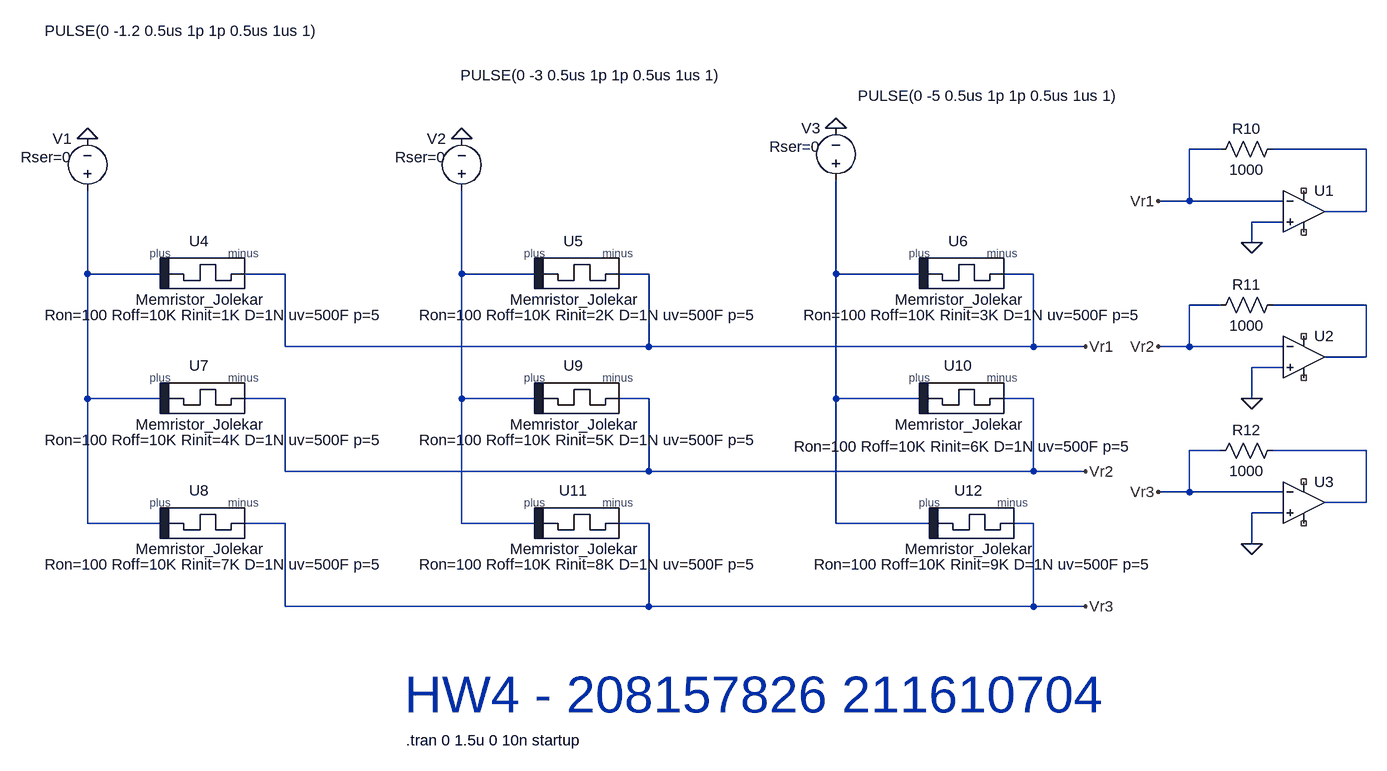
[diagram p0: schematic Q1_part_d.asc]
Q1_part_d.asc, the LTspice schematic file:
Version 4
SHEET 1 1608 768
WIRE 1008 -160 960 -160
WIRE 1232 -160 1088 -160
WIRE 960 -80 960 -160
WIRE 960 -80 912 -80
WIRE 1104 -80 960 -80
WIRE 1232 -64 1232 -160
WIRE 1232 -64 1168 -64
WIRE 1104 -48 1056 -48
WIRE 1056 -16 1056 -48
WIRE -736 32 -736 -96
WIRE -624 32 -736 32
WIRE -432 32 -496 32
WIRE -160 32 -160 -96
WIRE -48 32 -160 32
WIRE 128 32 80 32
WIRE 416 32 416 -112
WIRE 544 32 416 32
WIRE 720 32 672 32
WIRE 1008 80 960 80
WIRE 1232 80 1088 80
WIRE -432 144 -432 32
WIRE 128 144 128 32
WIRE 128 144 -432 144
WIRE 720 144 720 32
WIRE 720 144 128 144
WIRE 800 144 720 144
WIRE 960 144 960 80
WIRE 960 144 912 144
WIRE 1104 144 960 144
WIRE 1232 160 1232 80
WIRE 1232 160 1168 160
WIRE 1104 176 1056 176
WIRE -736 224 -736 32
WIRE -624 224 -736 224
WIRE -432 224 -496 224
WIRE -160 224 -160 32
WIRE -48 224 -160 224
WIRE 128 224 80 224
WIRE 416 224 416 32
WIRE 544 224 416 224
WIRE 720 224 672 224
WIRE 1056 224 1056 176
WIRE 1008 304 960 304
WIRE 1232 304 1088 304
WIRE -432 336 -432 224
WIRE 128 336 128 224
WIRE 128 336 -432 336
WIRE 720 336 720 224
WIRE 720 336 128 336
WIRE 800 336 720 336
WIRE 960 368 960 304
WIRE 960 368 912 368
WIRE 1104 368 960 368
WIRE 1232 384 1232 304
WIRE 1232 384 1168 384
WIRE 1104 400 1056 400
WIRE -736 416 -736 224
WIRE -624 416 -736 416
WIRE -432 416 -496 416
WIRE -160 416 -160 224
WIRE -48 416 -160 416
WIRE 128 416 80 416
WIRE 416 416 416 224
WIRE 560 416 416 416
WIRE 720 416 688 416
WIRE 1056 448 1056 400
WIRE -432 544 -432 416
WIRE 128 544 128 416
WIRE 128 544 -432 544
WIRE 720 544 720 416
WIRE 720 544 128 544
WIRE 800 544 720 544
FLAG -736 -176 0
FLAG -160 -176 0
FLAG 416 -192 0
FLAG 800 144 Vr1
FLAG 800 336 Vr2
FLAG 800 544 Vr3
FLAG 1056 -16 0
FLAG 1056 224 0
FLAG 1056 448 0
FLAG 912 -80 Vr1
FLAG 912 144 Vr2
FLAG 912 368 Vr3
SYMBOL voltage -736 -80 R180
WINDOW 0 24 96 Left 2
WINDOW 3 -356 262 Left 2
WINDOW 123 0 0 Left 0
WINDOW 39 24 68 Left 2
SYMATTR InstName V1
SYMATTR Value PULSE(0 -1.2 0.5us 1p 1p 0.5us 1us 1)
SYMATTR SpiceLine Rser=0
SYMBOL voltage -160 -80 R180
WINDOW 0 24 96 Left 2
WINDOW 3 -400 194 Left 2
WINDOW 123 0 0 Left 0
WINDOW 39 24 68 Left 2
SYMATTR InstName V2
SYMATTR Value PULSE(0 -3 0.5us 1p 1p 0.5us 1us 1)
SYMATTR SpiceLine Rser=0
SYMBOL voltage 416 -96 R180
WINDOW 0 24 96 Left 2
WINDOW 3 -436 146 Left 2
WINDOW 123 0 0 Left 0
WINDOW 39 24 68 Left 2
SYMATTR InstName V3
SYMATTR Value PULSE(0 -5 0.5us 1p 1p 0.5us 1us 1)
SYMATTR SpiceLine Rser=0
SYMBOL OpAmps\\UniversalOpAmp 1136 -64 R0
SYMATTR InstName U1
SYMATTR Value2 Avol=10Meg GBW=1000Meg Vos=0
SYMBOL OpAmps\\UniversalOpAmp 1136 160 R0
SYMATTR InstName U2
SYMATTR Value2 Avol=10Meg GBW=1000Meg Vos=0
SYMBOL OpAmps\\UniversalOpAmp 1136 384 R0
SYMATTR InstName U3
SYMATTR Value2 Avol=10Meg GBW=1000Meg Vos=0
SYMBOL res 1104 -176 R90
WINDOW 0 0 56 VBottom 2
WINDOW 3 32 56 VTop 2
SYMATTR InstName R10
SYMATTR Value 1000
SYMBOL res 1104 64 R90
WINDOW 0 0 56 VBottom 2
WINDOW 3 32 56 VTop 2
SYMATTR InstName R11
SYMATTR Value 1000
SYMBOL res 1104 288 R90
WINDOW 0 0 56 VBottom 2
WINDOW 3 32 56 VTop 2
SYMATTR InstName R12
SYMATTR Value 1000
SYMBOL Jolekar -560 32 R0
SYMATTR InstName U4
SYMATTR SpiceLine Ron=100 Roff=10K Rinit=1K D=1N uv=500F p=5
SYMBOL Jolekar 16 32 R0
SYMATTR InstName U5
SYMATTR SpiceLine Ron=100 Roff=10K Rinit=2K D=1N uv=500F p=5
SYMBOL Jolekar 608 32 R0
SYMATTR InstName U6
SYMATTR SpiceLine Ron=100 Roff=10K Rinit=3K D=1N uv=500F p=5
SYMBOL Jolekar -560 224 R0
SYMATTR InstName U7
SYMATTR SpiceLine Ron=100 Roff=10K Rinit=4K D=1N uv=500F p=5
SYMBOL Jolekar -560 416 R0
SYMATTR InstName U8
SYMATTR SpiceLine Ron=100 Roff=10K Rinit=7K D=1N uv=500F p=5
SYMBOL Jolekar 16 224 R0
SYMATTR InstName U9
SYMATTR SpiceLine Ron=100 Roff=10K Rinit=5K D=1N uv=500F p=5
SYMBOL Jolekar 608 224 R0
WINDOW 39 5 58 Top 2
SYMATTR InstName U10
SYMATTR SpiceLine Ron=100 Roff=10K Rinit=6K D=1N uv=500F p=5
SYMBOL Jolekar 16 416 R0
SYMATTR InstName U11
SYMATTR SpiceLine Ron=100 Roff=10K Rinit=8K D=1N uv=500F p=5
SYMBOL Jolekar 624 416 R0
SYMATTR InstName U12
SYMATTR SpiceLine Ron=100 Roff=10K Rinit=9K D=1N uv=500F p=5
TEXT -246 750 Left 2 !.tran 0 1.5u 0 10n startup
TEXT -248 680 Left 6 ;HW4 - 208157826 211610704

The netlist it stands for:
* Q1_part_d.asc
V1 N002 0 PULSE(0 -1.2 0.5us 1p 1p 0.5us 1us 1) Rser=0
V2 N003 0 PULSE(0 -3 0.5us 1p 1p 0.5us 1us 1) Rser=0
V3 N004 0 PULSE(0 -5 0.5us 1p 1p 0.5us 1us 1) Rser=0
XU1 0 Vr1 NC_01 NC_02 N001 level1 Avol=10Meg GBW=1000Meg Vos=0 En=0 Enk=0 In=0 Ink=0 Rin=500Meg  ; pins In+ In- V+ V- OUT
XU2 0 Vr2 NC_03 NC_04 N005 level1 Avol=10Meg GBW=1000Meg Vos=0 En=0 Enk=0 In=0 Ink=0 Rin=500Meg  ; pins In+ In- V+ V- OUT
XU3 0 Vr3 NC_05 NC_06 N006 level1 Avol=10Meg GBW=1000Meg Vos=0 En=0 Enk=0 In=0 Ink=0 Rin=500Meg  ; pins In+ In- V+ V- OUT
R10 N001 Vr1 1000
R11 N005 Vr2 1000
R12 N006 Vr3 1000
XU4 N002 Vr1 Memristor_Jolekar Ron=100 Roff=10K Rinit=1K D=1N uv=500F p=5  ; pins plus minus
XU5 N003 Vr1 Memristor_Jolekar Ron=100 Roff=10K Rinit=2K D=1N uv=500F p=5  ; pins plus minus
XU6 N004 Vr1 Memristor_Jolekar Ron=100 Roff=10K Rinit=3K D=1N uv=500F p=5  ; pins plus minus
XU7 N002 Vr2 Memristor_Jolekar Ron=100 Roff=10K Rinit=4K D=1N uv=500F p=5  ; pins plus minus
XU8 N002 Vr3 Memristor_Jolekar Ron=100 Roff=10K Rinit=7K D=1N uv=500F p=5  ; pins plus minus
XU9 N003 Vr2 Memristor_Jolekar Ron=100 Roff=10K Rinit=5K D=1N uv=500F p=5  ; pins plus minus
XU10 N004 Vr2 Memristor_Jolekar Ron=100 Roff=10K Rinit=6K D=1N uv=500F p=5  ; pins plus minus
XU11 N003 Vr3 Memristor_Jolekar Ron=100 Roff=10K Rinit=8K D=1N uv=500F p=5  ; pins plus minus
XU12 N004 Vr3 Memristor_Jolekar Ron=100 Roff=10K Rinit=9K D=1N uv=500F p=5  ; pins plus minus
.tran 0 1.5u 0 10n startup
* HW4 - 208157826 211610704
.lib UniversalOpAmp1.lib
.lib Jolekar.lib
.backanno
.end